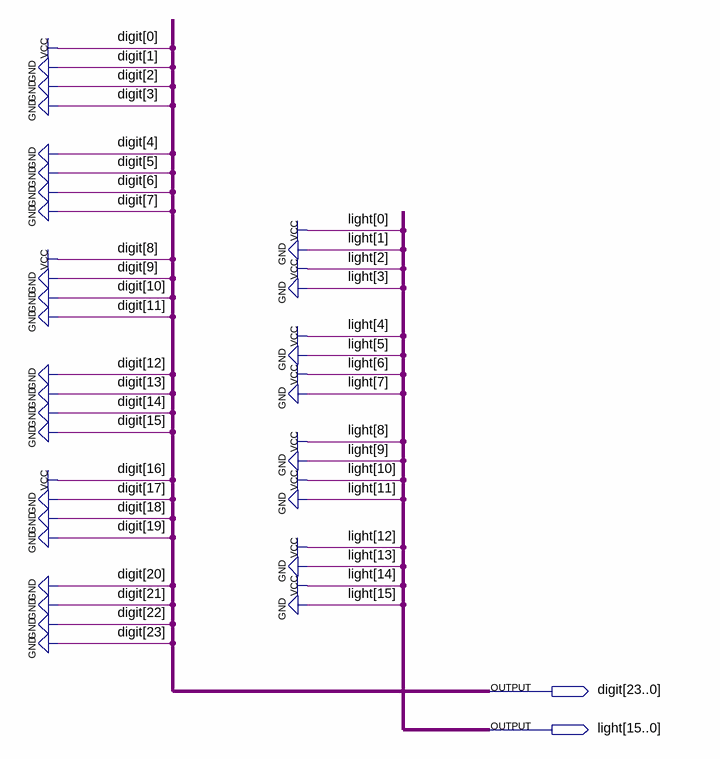
[diagram p0: schematic sheet]
// Quartus schematic Pattern_3_Frame_14.bdf as structural Verilog: 0 symbols, 2 pins
module Pattern_3_Frame_14 (
  output [23:0] digit,
  output [15:0] light
);


  assign digit = 24'b000000010000000100000001;
  assign light = 16'b0101010101010101;
endmodule
